# EAGLE schematic ECAM01_1 (EAGLE 7.3.0)

## Sheet 1 of 2
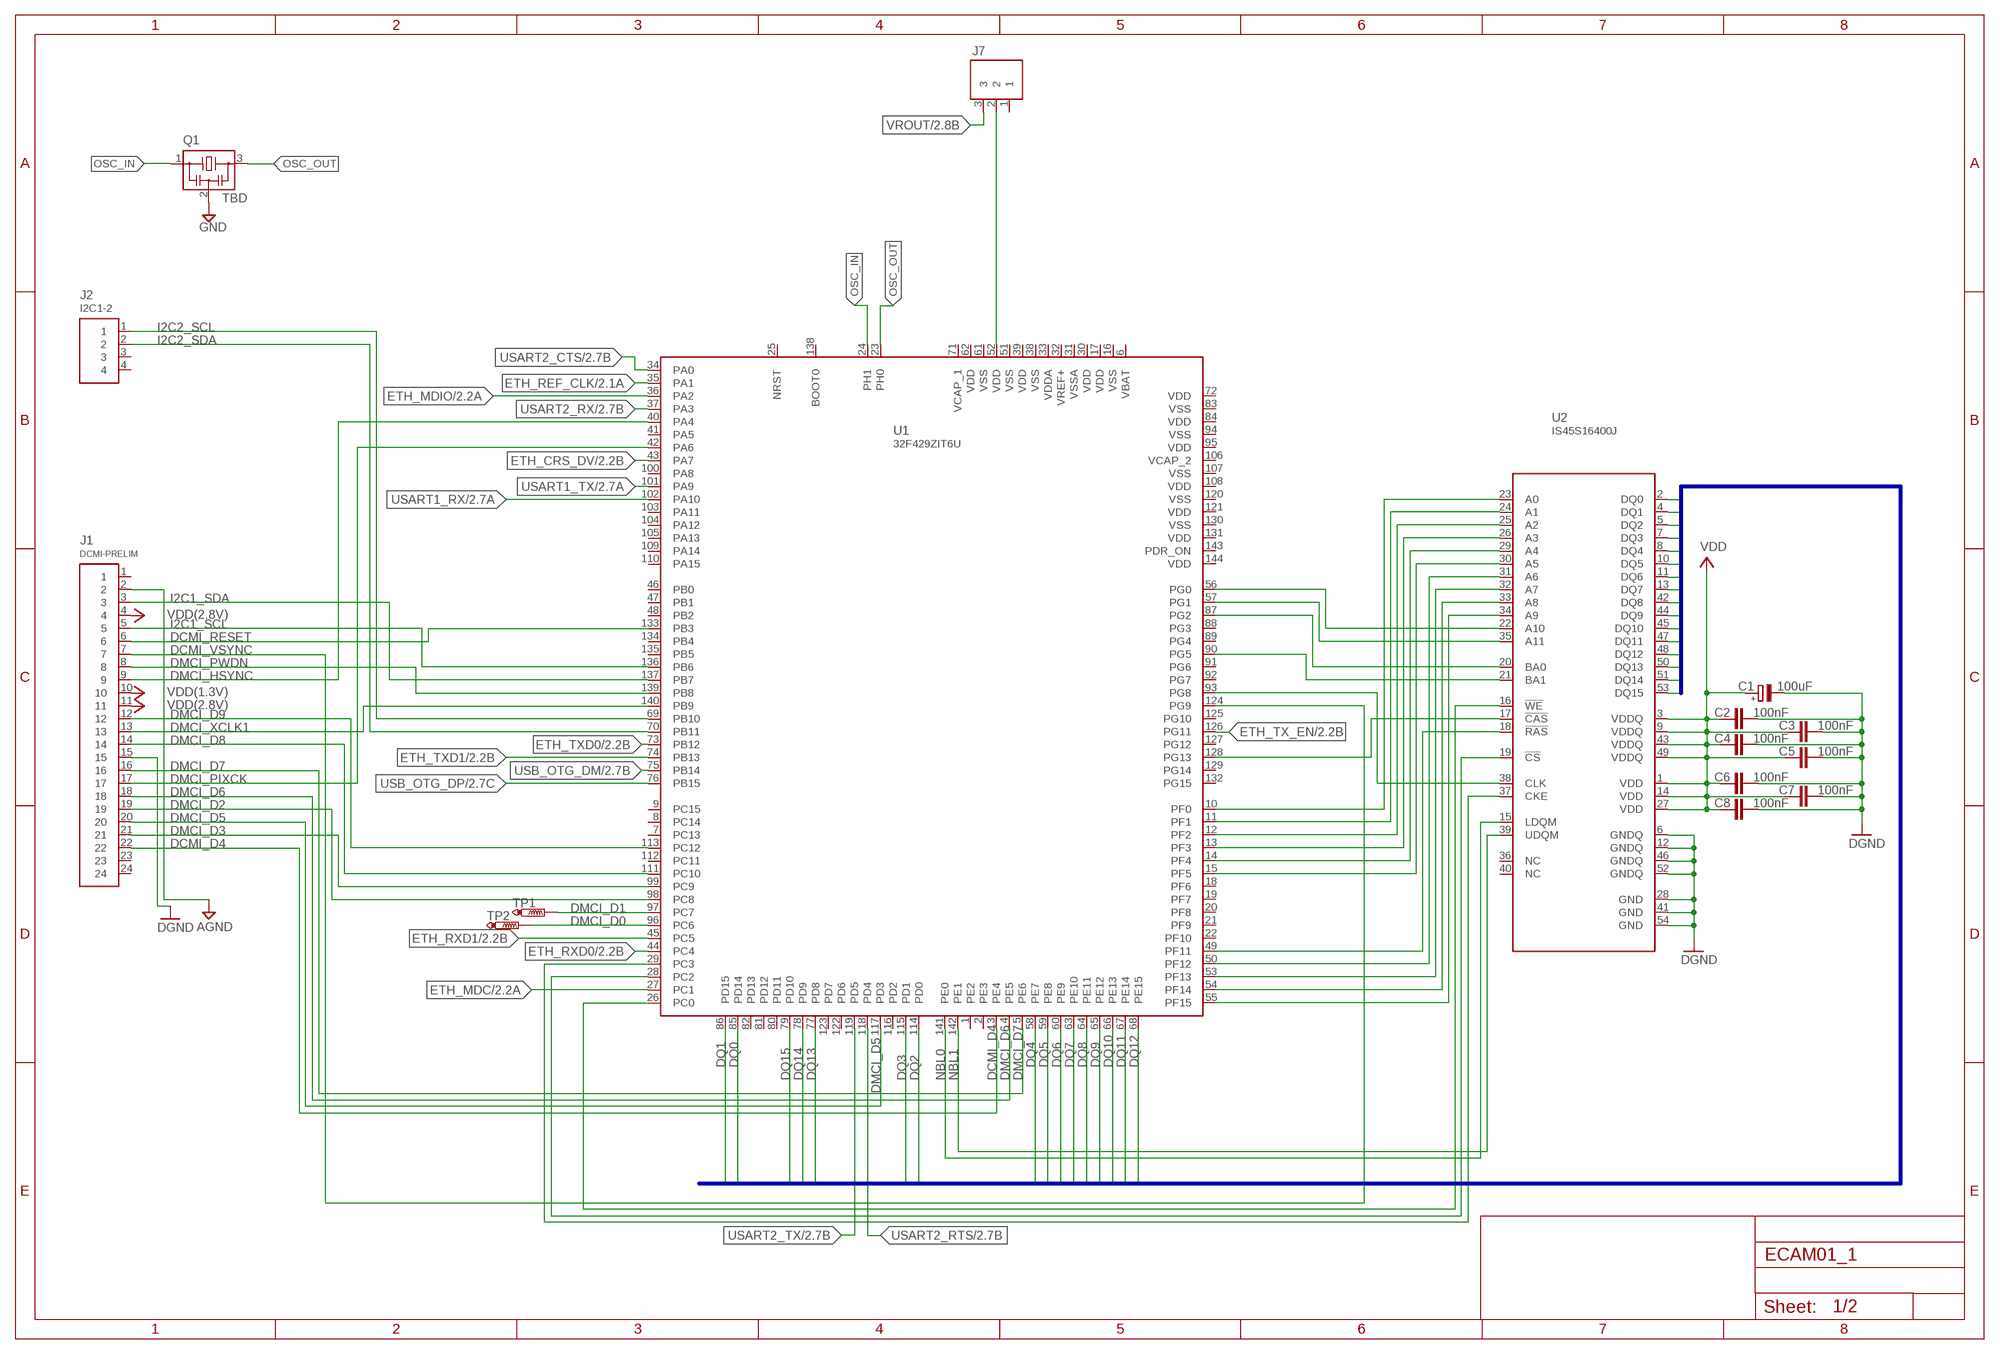
[diagram p0: schematic, sheet 1]

### Parts
C1  100uF  CPOL-EU085CS-1AR  [085CS_1AR]
C2  100nF  C-EUC0603  [C0603]
C3  100nF  C-EUC0603  [C0603]
C4  100nF  C-EUC0603  [C0603]
C5  100nF  C-EUC0603  [C0603]
C6  100nF  C-EUC0603  [C0603]
C7  100nF  C-EUC0603  [C0603]
C8  100nF  C-EUC0603  [C0603]
J1  DCMI-PRELIM  [CON-DCMI-PRELIM]
J2  I2C1-2  CPL-CON-HEADER-0.1IN-4P-M  [CON-HDR-4POS-MALE]
J7  CPL-CON-HEADER-0.1IN-3P-M  [CON-HDR-3POS-MALE]
Q1  TBD  CSTCR6M00G53Z  [CSTCR6M]
TP1  PTR1PAD1-20  [P1-20]
TP2  PTR1PAD1-20  [P1-20]
U1  32F429ZIT6U  [LQFP144]
U2  IS45S16400J  [54-TSOP]

### Nets
AGND: J1.2
DCMI_D4: J1.22 U1.3(PE4)
DCMI_RESET: J1.6 U1.133(PB3)
DCMI_VSYNC: J1.7 U1.124(PG9)
DMCI_D0: TP2.TP U1.96(PC6)
DMCI_D1: TP1.TP U1.97(PC7)
DMCI_D2: J1.19 U1.98(PC8)
DMCI_D3: J1.21 U1.99(PC9)
DMCI_D5: J1.20 U1.117(PD3)
DMCI_D6: J1.18 U1.4(PE5)
DMCI_D7: J1.16 U1.5(PE6)
DMCI_D8: J1.14 U1.111(PC10)
DMCI_D9: J1.12 U1.113(PC12)
DMCI_HSYNC: J1.9 U1.40(PA4)
DMCI_PIXCK: J1.17 U1.42(PA6)
DMCI_PWDN: J1.8 U1.139(PB8)
DMCI_XCLK1: J1.13 U1.140(PB9)
DQ0: U1.85(PD14) U2.2(DQ0)
DQ1: U1.86(PD15) U2.4(DQ1)
DQ2: U1.114(PD0) U2.5(DQ2)
DQ3: U1.115(PD1) U2.7(DQ3)
DQ4: U1.58(PE7) U2.8(DQ4)
DQ5: U1.59(PE8) U2.10(DQ5)
DQ6: U1.60(PE9) U2.11(DQ6)
DQ7: U1.63(PE10) U2.13(DQ7)
DQ8: U1.64(PE11) U2.42(DQ8)
DQ9: U1.65(PE12) U2.44(DQ9)
DQ10: U1.66(PE13) U2.45(DQ10)
DQ11: U1.67(PE14) U2.47(DQ11)
DQ12: U1.68(PE15) U2.48(DQ12)
DQ13: U1.77(PD8) U2.50(DQ13)
DQ14: U1.78(PD9) U2.51(DQ14)
DQ15: U1.79(PD10) U2.53(DQ15)
ETH_CRS_DV: U1.43(PA7) ; also sheet 2
ETH_MDC: U1.27(PC1) ; also sheet 2
ETH_MDIO: U1.36(PA2) ; also sheet 2
ETH_REF_CLK: U1.35(PA1) ; also sheet 2
ETH_RXD0: U1.44(PC4) ; also sheet 2
ETH_RXD1: U1.45(PC5) ; also sheet 2
ETH_TX_EN: U1.126(PG11) ; also sheet 2
ETH_TXD0: U1.73(PB12) ; also sheet 2
ETH_TXD1: U1.74(PB13) ; also sheet 2
GND: C1.- C2.2 C3.2 C4.2 C5.2 C6.2 C7.2 C8.2 J1.15 Q1.2 U2.6(GNDQ) U2.12(GNDQ) U2.28(GND) U2.41(GND) U2.46(GNDQ) U2.52(GNDQ) U2.54(GND) ; supply symbol labelled DGND ; also sheet 2
I2C1_SCL: J1.5 U1.136(PB6)
I2C1_SDA: J1.3 U1.137(PB7)
I2C2_SCL: J2.1 U1.69(PB10)
I2C2_SDA: J2.2 U1.70(PB11)
N$1: U1.10(PF0) U2.23(A0)
N$2: U1.11(PF1) U2.24(A1)
N$3: U1.12(PF2) U2.25(A2)
N$4: U1.13(PF3) U2.26(A3)
N$5: U1.14(PF4) U2.29(A4)
N$6: U1.15(PF5) U2.30(A5)
N$7: U1.26(PC0) U2.16(!WE)
N$8: U1.29(PC3) U2.37(CKE)
N$9: U1.49(PF11) U2.18(!RAS)
N$10: U1.50(PF12) U2.31(A6)
N$11: U1.53(PF13) U2.32(A7)
N$12: U1.54(PF14) U2.33(A8)
N$13: U1.55(PF15) U2.34(A9)
N$14: U1.56(PG0) U2.22(A10)
N$15: U1.57(PG1) U2.35(A11)
N$30: U1.87(PG2) U2.20(BA0)
N$31: U1.90(PG5) U2.21(BA1)
N$32: U1.93(PG8) U2.38(CLK)
N$35: U1.128(PG13) U2.17(!CAS)
N$38: U1.28(PC2) U2.19(!CS)
NBL0: U1.141(PE0) U2.15(LDQM)
NBL1: U1.142(PE1) U2.39(UDQM)
OSC_IN: Q1.1 U1.24(PH1)
OSC_OUT: Q1.3 U1.23(PH0)
USART1_RX: U1.102(PA10) ; also sheet 2
USART1_TX: U1.101(PA9) ; also sheet 2
USART2_CTS: U1.34(PA0) ; also sheet 2
USART2_RTS: U1.118(PD4) ; also sheet 2
USART2_RX: U1.37(PA3) ; also sheet 2
USART2_TX: U1.119(PD5) ; also sheet 2
USB_OTG_DM: U1.75(PB14) ; also sheet 2
USB_OTG_DP: U1.76(PB15) ; also sheet 2
VCC: C1.+ C2.1 C3.1 C4.1 C5.1 C6.1 C7.1 C8.1 U2.1(VDD) U2.3(VDDQ) U2.9(VDDQ) U2.14(VDD) U2.27(VDD) U2.43(VDDQ) U2.49(VDDQ) ; supply symbol labelled VDD
VDD: J1.4 J1.10 J1.11 J7.2 U1.52(VDD) ; supply symbol labelled VDD(2.8V), VDD(1.3V)
VROUT: J7.3 ; also sheet 2
Unconnected: J1.1 J1.23 J1.24 J2.3 J2.4 J7.1 U1.1(PE2) U1.2(PE3) U1.7(PC13) U1.8(PC14) U1.9(PC15) U1.18(PF6) U1.19(PF7) U1.20(PF8) U1.21(PF9) U1.22(PF10) U1.25(NRST) U1.41(PA5) U1.46(PB0) U1.47(PB1) U1.48(PB2) U1.80(PD11) U1.81(PD12) U1.82(PD13) U1.88(PG3) U1.89(PG4) U1.91(PG6) U1.92(PG7) U1.100(PA8) U1.103(PA11) U1.104(PA12) U1.105(PA13) U1.109(PA14) U1.110(PA15) U1.112(PC11) U1.116(PD2) U1.122(PD6) U1.123(PD7) U1.125(PG10) U1.127(PG12) U1.129(PG14) U1.132(PG15) U1.134(PB4) U1.135(PB5) U1.138(BOOT0) U2.36(NC) U2.40(NC)

### Buses
DQ[0..15]

## Sheet 2 of 2
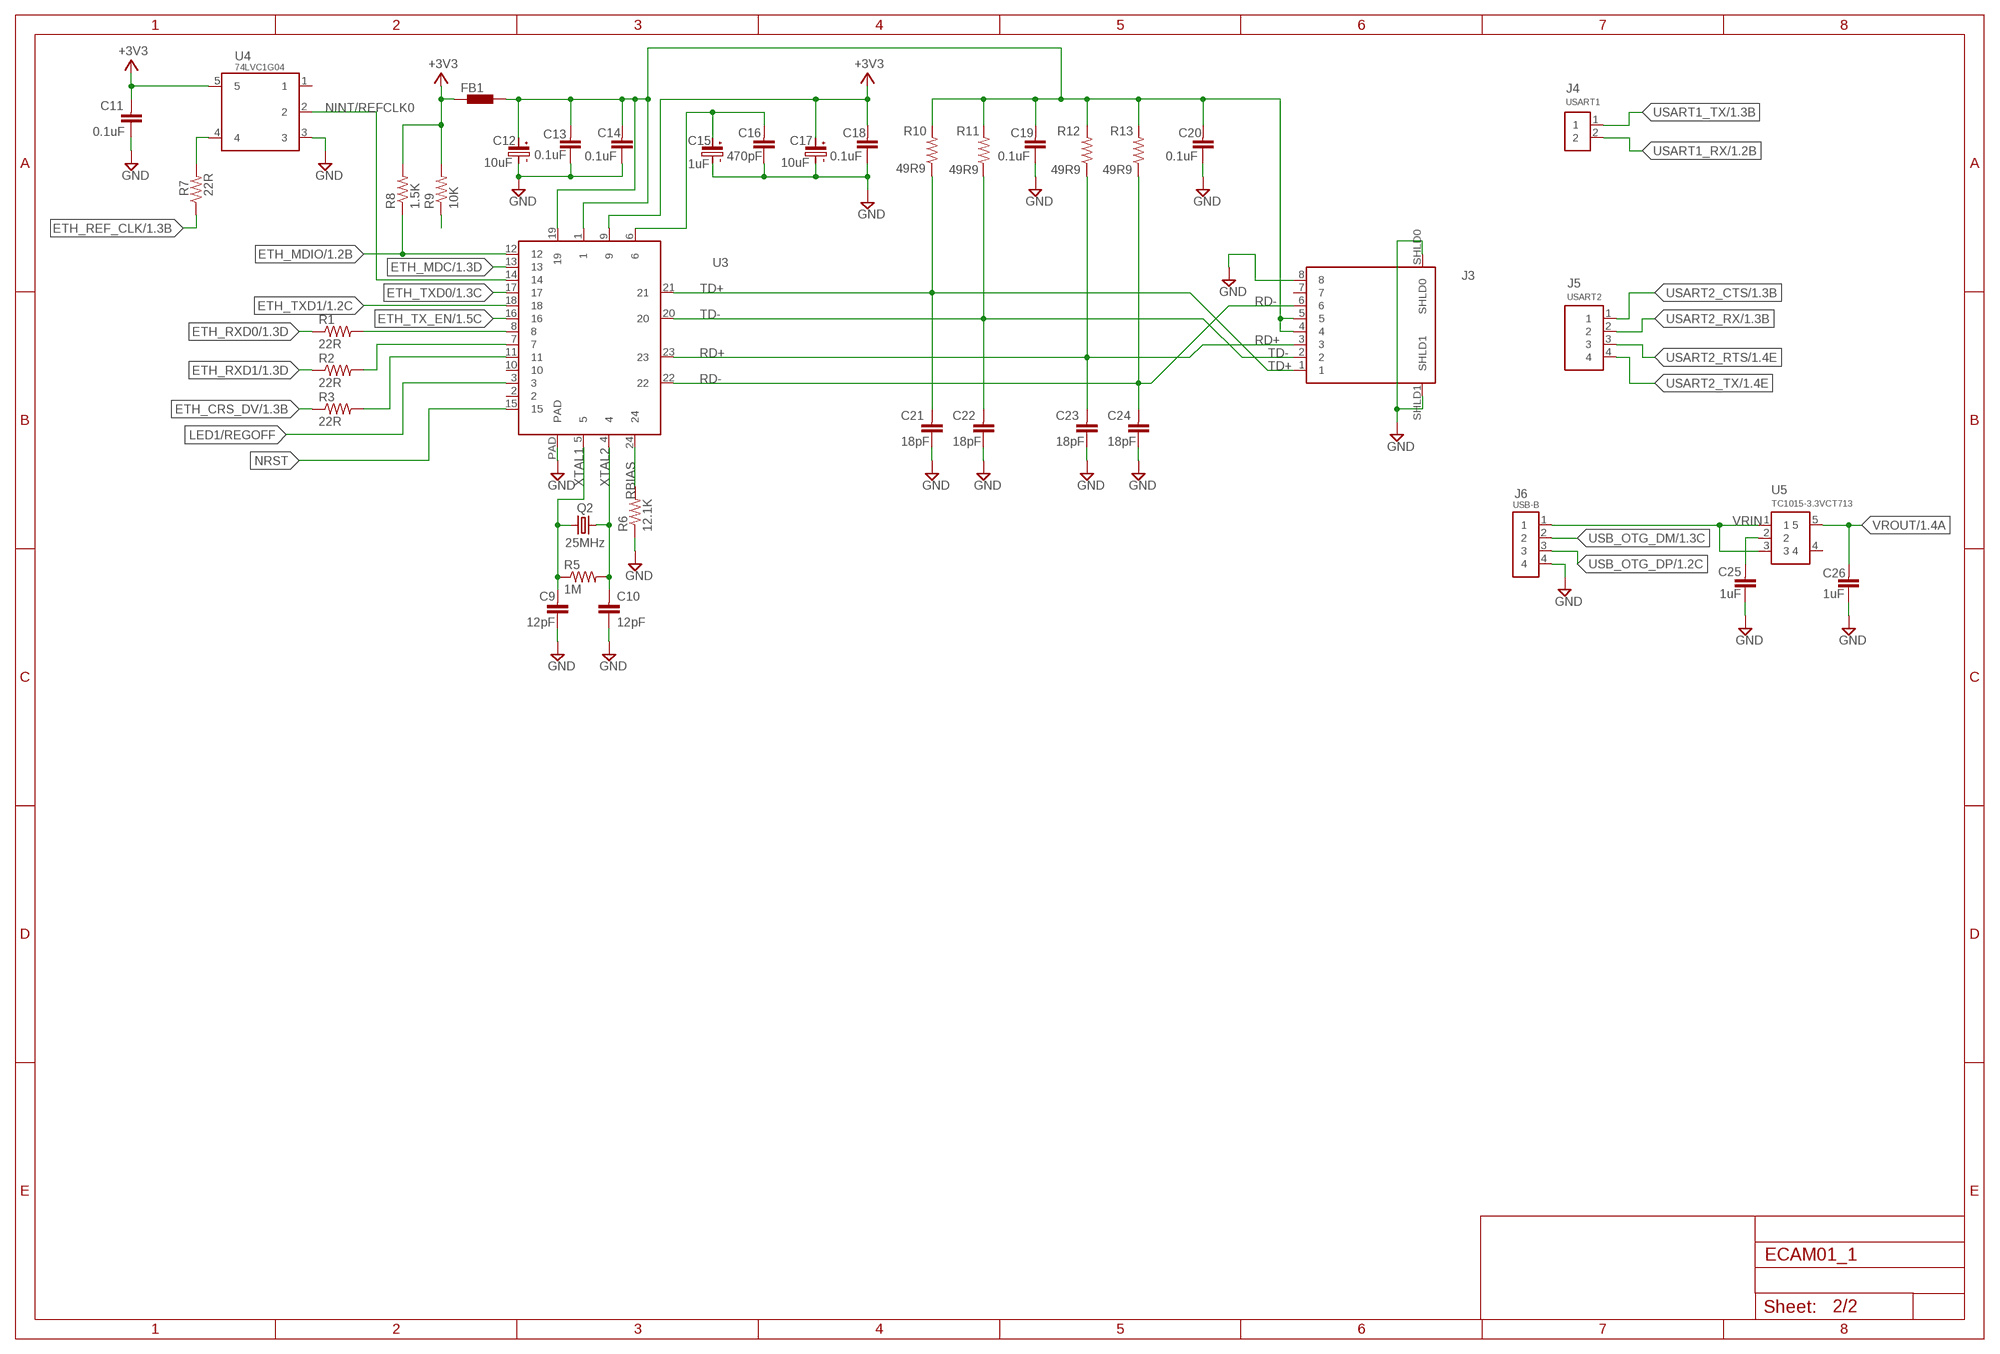
[diagram p1: schematic, sheet 2]

### Parts
C9  12pF  CPL-CAP-C0G-0603-12PF-50V  [C0603]
C10  12pF  CPL-CAP-C0G-0603-12PF-50V  [C0603]
C11  0.1uF  CPL-CAP-X5R-0603-0.1UF-35V  [C0603]
C12  10uF  CPL-CAP-ALU-RAD-10UF-50V  [C-RAD-6.3MM]
C13  0.1uF  CPL-CAP-X7R-0603-0.1UF-35V  [C0603]
C14  0.1uF  CPL-CAP-X7R-0603-0.1UF-35V  [C0603]
C15  1uF  CPL-CAP-ALU-SMD-1UF-50V  [C-SMD-4MM]
C16  470pF  CPL-CAP-X7R-0603-470PF-100V  [C0603]
C17  10uF  CPL-CAP-ALU-RAD-10UF-50V  [C-RAD-6.3MM]
C18  0.1uF  CPL-CAP-X7R-0603-0.1UF-35V  [C0603]
C19  0.1uF  CPL-CAP-X7R-0603-0.1UF-35V  [C0603]
C20  0.1uF  CPL-CAP-X7R-0603-0.1UF-35V  [C0603]
C21  18pF  CPL-CAP-C0G-0603-18PF-50V  [C0603]
C22  18pF  CPL-CAP-C0G-0603-18PF-50V  [C0603]
C23  18pF  CPL-CAP-C0G-0603-18PF-50V  [C0603]
C24  18pF  CPL-CAP-C0G-0603-18PF-50V  [C0603]
C25  1uF  CPL-CAP-X5R-0603-1UF-50V  [C0603]
C26  1uF  CPL-CAP-X5R-0603-1UF-50V  [C0603]
FB1  BLM15H0603  [F0603]
J3  CPL-ETH-MAGJACK-PULSE  [ETH-MAGJACK]
J4  USART1  CPL-CON-HEADER-0.1IN-2P-M  [CON-HDR-2POS-MALE]
J5  USART2  CPL-CON-HEADER-0.1IN-4P-M  [CON-HDR-4POS-MALE]
J6  USB-B  CPL-CON-USB-B  [USB-B(THRU)]
Q2  25MHz  CPL-OSC-CRY-25MHZ-18PF  [HC-49/U-S]
R1  22R  CPL-RES-0603-22R-0.1W  [R0603]
R2  22R  CPL-RES-0603-22R-0.1W  [R0603]
R3  22R  CPL-RES-0603-22R-0.1W  [R0603]
R5  1M  CPL-RES-0603-1M-0.1W  [R0603]
R6  12.1K  CPL-RES-0603-12.1K-0.1W  [R0603]
R7  22R  CPL-RES-0603-22R-0.1W  [R0603]
R8  1.5K  CPL-RES-0603-1.5K-50V  [R0603]
R9  10K  CPL-RES-0603-10K-0.1W  [R0603]
R10  49R9  CPL-RES-0603-49.9-0.1W  [R0603]
R11  49R9  CPL-RES-0603-49.9-0.1W  [R0603]
R12  49R9  CPL-RES-0603-49.9-0.1W  [R0603]
R13  49R9  CPL-RES-0603-49.9-0.1W  [R0603]
U3  CPL-ETH-PHY-LAN8720A  [QFN-24]
U4  74LVC1G04  CPL-INV-SOT25-5.5V-3.3V  [SOT-25]
U5  TC1015-3.3VCT713  CPL-REG-LIN-3.3V-0.1A  [SOT-23-5]

### Nets
+3V3: C11.2 C17.POS C18.2 FB1.1 R8.2 R9.2 U3.9 U4.5
ETH_CRS_DV: R3.1 ; also sheet 1
ETH_MDC: U3.13 ; also sheet 1
ETH_MDIO: R8.1 U3.12 ; also sheet 1
ETH_REF_CLK: R7.1 ; also sheet 1
ETH_RX_ER: R9.1
ETH_RXD0: R1.1 ; also sheet 1
ETH_RXD1: R2.1 ; also sheet 1
ETH_TX_EN: U3.16 ; also sheet 1
ETH_TXD0: U3.17 ; also sheet 1
ETH_TXD1: U3.18 ; also sheet 1
GND: C9.1 C10.1 C11.1 C12.NEG C13.1 C14.1 C15.NEG C16.1 C17.NEG C18.1 C19.1 C20.1 C21.1 C22.1 C23.1 C24.1 C25.1 C26.1 J3.8 J3.SHLD0 J3.SHLD1 J6.4 R6.1 U3.PAD U4.3 ; also sheet 1
LED1/REGOFF: U3.3
N$16: R1.2 U3.8
N$17: C25.2 U5.2
N$18: R2.2 U3.7
N$19: R3.2 U3.11
N$21: R7.2 U4.4
N$22: C12.POS C13.2 C14.2 C19.2 C20.2 FB1.2 J3.4 J3.5 R10.2 R11.2 R12.2 R13.2 U3.1 U3.19
N$23: C15.POS C16.2 U3.6
NINT/REFCLK0: U3.14 U4.2
NRST: U3.15
RBIAS: R6.2 U3.24
RD+: C23.2 J3.3 R12.1 U3.23
RD-: C24.2 J3.6 R13.1 U3.22
TD+: C21.2 J3.1 R10.1 U3.21
TD-: C22.2 J3.2 R11.1 U3.20
USART1_RX: J4.2 ; also sheet 1
USART1_TX: J4.1 ; also sheet 1
USART2_CTS: J5.1 ; also sheet 1
USART2_RTS: J5.3 ; also sheet 1
USART2_RX: J5.2 ; also sheet 1
USART2_TX: J5.4 ; also sheet 1
USB_OTG_DM: J6.2 ; also sheet 1
USB_OTG_DP: J6.3 ; also sheet 1
VRIN: J6.1 U5.1 U5.3
VROUT: C26.2 U5.5 ; also sheet 1
XTAL1: C9.2 Q2.1 R5.1 U3.5
XTAL2: C10.2 Q2.2 R5.2 U3.4
Unconnected: J3.7 U3.2 U3.10 U4.1 U5.4

## Power pins joined to a net without a drawn wire
PDR_ON: U1.143(PDR_ON)
VBAT: U1.6(VBAT)
VCAP_1: U1.71(VCAP_1)
VCAP_2: U1.106(VCAP_2)
VDD: U1.17(VDD) U1.30(VDD) U1.39(VDD) U1.62(VDD) U1.72(VDD) U1.84(VDD) U1.95(VDD) U1.108(VDD) U1.121(VDD) U1.131(VDD) U1.144(VDD)
VDDA: U1.33(VDDA)
VREF+: U1.32(VREF+)
VSS: U1.16(VSS) U1.38(VSS) U1.51(VSS) U1.61(VSS) U1.83(VSS) U1.94(VSS) U1.107(VSS) U1.120(VSS) U1.130(VSS)
VSSA: U1.31(VSSA)

## Library data of the parts
C1 = rcl:CPOL-EU: POLARIZED CAPACITOR, European symbol
C2-C8 = rcl:C-EU: CAPACITOR, European symbol
C9 C10 = TinWhiskers:CPL-CAP-C0G-0603-12PF-50V: Capacitor: 12pF, 50V, 5%; Package: 0603; Datasheet: http://download.siliconexpert.com/pdfs/2011/4/6/10/1/57/701/samelm_/manual/cl10c120jb8nnnc.pdf
C11 = TinWhiskers:CPL-CAP-X5R-0603-0.1UF-35V: Capacitor: 0.1uF, 35V, 10%, X5R; Package: 0603; Datasheet: http://www.yuden.co.jp/productdata/catalog/en/mlcc01_hq_e.pdf
C12 C17 = TinWhiskers:CPL-CAP-ALU-RAD-10UF-50V
C13 C14 C18-C20 = TinWhiskers:CPL-CAP-X7R-0603-0.1UF-35V: Capacitor: 0.1uF, 35V, 10%, X7R; Package: 0603; Datasheet: http://www.yuden.co.jp/productdata/catalog/en/mlcc01_hq_e.pdf
C15 = TinWhiskers:CPL-CAP-ALU-SMD-1UF-50V: Capacitor, Al-Electrolytic: 1uF, 50v, 20%; Package: 4mm Barrel (SMD); Datasheet: http://www.mouser.com/ds/2/212/KEM_A4001_EDK-535350.pdf
C16 = TinWhiskers:CPL-CAP-X7R-0603-470PF-100V: Capacitor: 470pF, 100V, 5%; Package: 0603 Datasheet: http://www.mouser.com/ds/2/427/vjw1bcbascomseries-223529.pdf
C21-C24 = TinWhiskers:CPL-CAP-C0G-0603-18PF-50V: Capacitor: 18pF, 50V, 5%; Package: 0603; Datasheet: http://www.mouser.com/ds/2/427/vjw1bcbascomseries-223529.pdf
C25 C26 = TinWhiskers:CPL-CAP-X5R-0603-1UF-50V: Capacitor: 0.1uF, 50V, 10%; Package: 0603; Datasheet: http://www.mouser.com/ds/2/396/mlcc_all_e-541559.pdf
FB1 = TinWhiskers:BLM15H: EMIFIL (R) Chip Ferrite Bead for GHz Noise Source: http://www.murata.com/ Ferrite Bead BLM15H.pdf
J1 = TinWhiskers:DCMI-PRELIM: Connector: Dig. Camera Interface (DCMI), 24-pin;
J2 J5 = TinWhiskers:CPL-CON-HEADER-0.1IN-4P-M
J3 = TinWhiskers:CPL-ETH-MAGJACK-PULSE: Ethernet MagJack; Datasheet: http://www.mouser.com/ds/2/336/-180197.pdf
J4 = TinWhiskers:CPL-CON-HEADER-0.1IN-2P-M: Connector: Header, 2-P, 0.1" Pitch
J6 = TinWhiskers:CPL-CON-USB-B: Connector: USB, B-type
J7 = TinWhiskers:CPL-CON-HEADER-0.1IN-3P-M
Q1 = TinWhiskers:CSTCR: Resonator Source: murata.co.jp; MPN: CSTCR6M00G53-R0; OC_FARNELL: 1170434; OC_NEWARK: 25M8759
Q2 = TinWhiskers:CPL-OSC-CRY-25MHZ-18PF: Crystal Oscillator: 25MHz, 18pF, 30PPM; Package: HC-49/U-S; Datasheet: http://www.mouser.com/ds/2/77/HCM49-5106.pdf
R1-R3 R7 = TinWhiskers:CPL-RES-0603-22R-0.1W: Resistor, 22 Ohm, 0.1W, 10%; Package: 0603
R5 = TinWhiskers:CPL-RES-0603-1M-0.1W: Resistor: 1MOhm, 0.1W, 5%; Package: 0603; Datasheet: http://www.samsungsem.com/global/support/library/product-catalog/__icsFiles/afieldfile/2015/01/12/CHIP_RESISTOR_150112_1.pdf
R6 = TinWhiskers:CPL-RES-0603-12.1K-0.1W: Resistor: 12.1 kOhm, 0.1W, 1%; Package: 0603; Datasheet: http://www.samsungsem.com/global/support/library/product-catalog/__icsFiles/afieldfile/2015/01/12/CHIP_RESISTOR_150112_1.pdf
R8 = TinWhiskers:CPL-RES-0603-1.5K-50V: Resistor: 1.5KOhm, 0.1W, 5%; Package: 0603; Datasheet: http://www.mouser.com/ds/2/427/dcrcwe3-109170.pdf
R9 = TinWhiskers:CPL-RES-0603-10K-0.1W: Resistor: 10kOhm, 0.1W, 1%; Package: 0603; Datasheet: http://www.mouser.com/ds/2/315/AOA0000CE2-37512.pdf
R10-R13 = TinWhiskers:CPL-RES-0603-49.9-0.1W: Resistor: 49.9Ohms, 0.1W, 1%; Package: 0603; Datasheet: http://www.mouser.com/ds/2/219/RN73H-12200.pdf
TP1 TP2 = testpad:PTR1: TEST PIN
U1 = TinWhiskers:32F429ZIT6U: STMicroelectronics CPU chip
U2 = TinWhiskers:IS45S16400J: IS45S16400J (SDRAM; Mfr: ISSI); Specs: http://www.issi.com/WW/pdf/42-45S16400J.pdf
U3 = TinWhiskers:CPL-ETH-PHY-LAN8720A: Physical Ethernet Chip; Package: QFN-24; Datasheet: http://ww1.microchip.com/downloads/en/DeviceDoc/8720a.pdf
U4 = TinWhiskers:CPL-INV-SOT25-5.5V-3.3V: Single Inverter; Package: SOT-25; Datasheet: http://www.mouser.com/ds/2/115/74LVC1G04-72218.pdf
U5 = TinWhiskers:CPL-REG-LIN-3.3V-0.1A: Voltage Regulator: Linear, Vmax=6, Vout=3.3V, Io=0.1mA; Package: SOT-23-5 Datasheet: http://www.mouser.com/ds/2/268/21335b-29125.pdf